# Altium schematic sheet Sheet1.SchDoc: Отладочная плата
size 209 x 297 mm; Date: 06.12.2023; ApprovedBy: Максимов; CheckedBy: Максимов; Author: Деминов; CompanyName: АГУ; DrawnBy: Деминов; Engineer: Деминов; Organization: АГУ; DocumentNumber: № 1AA; SheetTotal: 1; PageSetup: Record=PageOptions|CenterHorizontal=True|CenterVertical=True|PrintScale=0.94|XCorrection=1.00|YCorrection=1.00|PrintKind=2|BorderSize=5000000|LeftOffset=0|BottomOffset=0|Orientation=1|PaperLength=2970|PaperWidth=2100|Scale=100|PaperSource=7|PrintQuality=600|MediaType=1|DitherType=10|PaperKind=A4|PrintScaleMode=1; Title1str: на зачёт; DocumentType: Тип схемы; Format: A4; ImagePath: 1
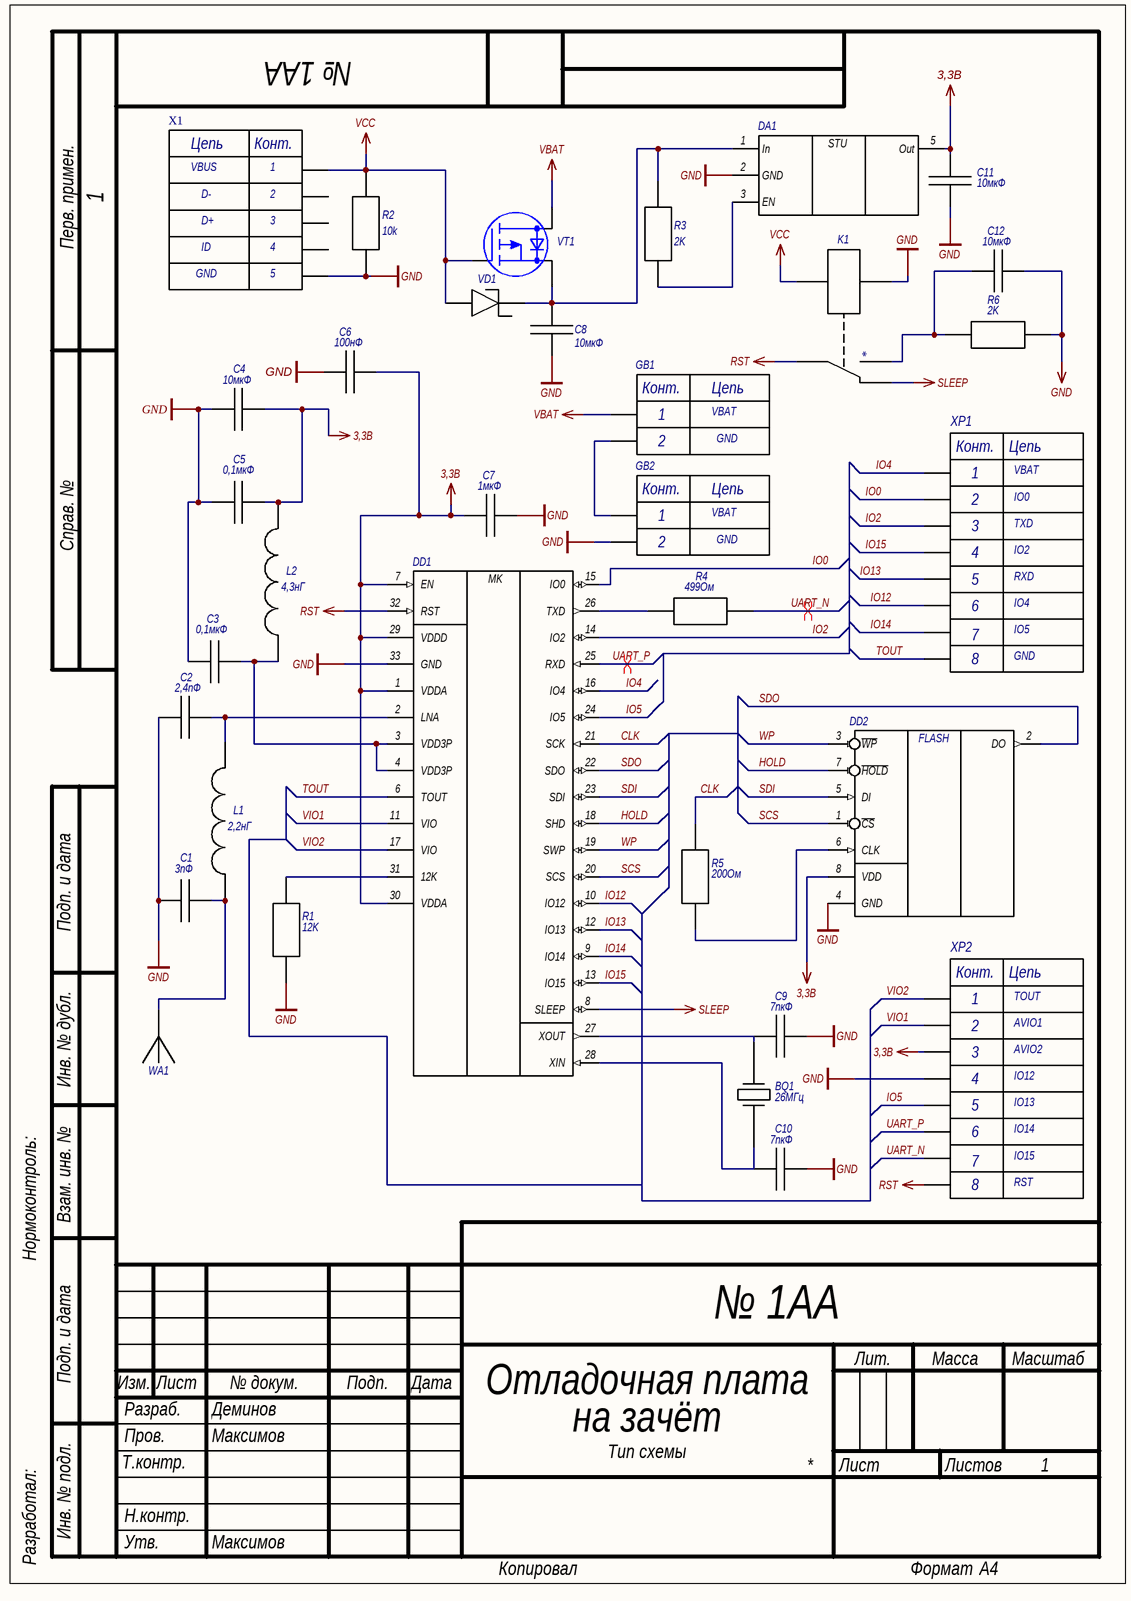
[diagram p0: Sheet1.SchDoc]

## Parts
*  WA1
BQ1  26МГц  [SMD02520C4]
C1  3пФ  [0201 C0G 7пФ 25В]
C2  2,4пФ  [0201 C0G 7пФ 25В]
C3  0,1мкФ  [RES 0402]
C4  10мкФ  [FB 0603]
C5  0,1мкФ  [RES 0402]
C6  100нФ  [RES 0402]
C7  1мкФ  [FB 0603]
C8  10мкФ  [FB 0603]
C9  7пкФ  [0201 C0G 7пФ 25В]
C10  7пкФ  [0201 C0G 7пФ 25В]
C11  10мкФ  [FB 0603]
C12  10мкФ  [FB 0603]
DA1  ap2112  [2112]  (value not drawn)
DD1  esp8266ex  [ESP8266]  (value not drawn)
DD2  M25P16-VMN6TP  [SOIC-8(3.90мм)]  (value not drawn)
GB1  battery_x2  [Battery_x2AA]  (value not drawn)
GB2  battery_x2  [Battery_x2AA]  (value not drawn)
K1  gost relay  [RELE]  (value not drawn)
L1  2,2нГ  [FB 0603]
L2  4,3нГ  [RES 0402]
R1  12K  [RES 0805]
R2  10k  [RES 0805]
R3  2K  [RES 0805]
R4  499Ом  [RES 0805]
R5  200Ом  [RES 0805]
R6  2K  [RES 0805]
VD1  (no value)  [MBR120]
VT1  (no value)  [SOT23-3]
X1  usb_micro  [USB_mini_B]  (value not drawn)
XP1  PLD-8  [PLD-8]  (value not drawn)
XP2  PLD-8  [PLD-8]  (value not drawn)

## Nets
3,3B: C4.2 C5.1 C6.1 C7.1 C11.2 DA1.5(Out) DD1.1(VDDA) DD1.7(EN) DD1.29(VDDD) DD1.30(VDDA) DD2.8(VDD) L2.2 XP2.3
GND: C1.2 C2.2 C3.2 C4.1 C5.2 C6.2 C7.2 C8.1 C9.1 C10.1 C11.1 C12.1 DA1.2(GND) DD1.33(GND) DD2.4(GND) GB2.2 K1.8 R1.2 R2.2 R6.1 X1.5 XP2.4
RST: DD1.32(RST) K1.3 XP2.8
SLEEP: DD1.8(SLEEP) K1.4
VBAT: GB1.1 VT1.2(D)
VCC: K1.1 R2.1 VD1.2 VT1.1(G) X1.1
CLK: DD1.21(SCK) R5.1
HOLD: DD1.18(SHD) DD2.7(~{HOLD})
IO0: DD1.15(IO0) XP1.2
IO2: DD1.14(IO2) XP1.3
IO4: DD1.16(IO4) XP1.1
IO5: DD1.24(IO5) XP2.5
IO12: DD1.10(IO12) XP1.6
IO13: DD1.12(IO13) XP1.5
IO14: DD1.9(IO14) XP1.7
IO15: DD1.13(IO15) XP1.4
SCS: DD1.20(SCS) DD2.1(~{CS})
SDI: DD1.23(SDI) DD2.5(DI)
SDO: DD1.22(SDO) DD2.2(DO)
TOUT: DD1.6(TOUT) XP1.8
UART_N: R4.2 XP2.7
UART_P: DD1.25(RXD) XP2.6
VIO1: DD1.11(VIO) XP2.2
VIO2: DD1.17(VIO) XP2.1
WP: DD1.19(SWP) DD2.3(~{WP})
Net*_IN: *.IN C1.1 L1.1
NetBQ1_1: BQ1.1 C10.2 DD1.28(XIN)
NetBQ1_3: BQ1.3 C9.2 DD1.27(XOUT)
NetC2_1: C2.1 DD1.2(LNA) L1.2
NetC3_1: C3.1 DD1.3(VDD3P) DD1.4(VDD3P) L2.1
NetC8_2: C8.2 DA1.1(In) R3.2 VD1.1 VT1.3(S)
NetC12_2: C12.2 K1.3 R6.2
NetDA1_3: DA1.3(EN) R3.1
NetDD1_26: DD1.26(TXD) R4.1
NetDD1_31: DD1.31(12K) R1.1
NetDD2_6: DD2.6(CLK) R5.2
NetGB1_2: GB1.2 GB2.1

Not connected (* = marked no-connect by the designer): X1 2 3 4

## Layout directives
differential pair: UART_N, UART_P

## Notes on the sheet
- Перв. примен.
- Справ. №
- VBAT
- IO0
- TXD
- IO2
- RXD
- IO4
- IO5
- GND
- Подп. и дата
- TOUT
- Инв. № дубл.
- AVIO1
- AVIO2
- IO12
- IO13
- IO14
- Нормоконтроль:
- Взам. инв. №
- IO15
- RST
- Изм.
- Лист
- № докум.
- Подп.
- Дата
- Лит.
- Масса
- Масштаб
- Т.контр.
- Пров.
- Разраб.
- Листов
- Разработал:
- Инв. № подл.
- Н.контр.
- Утв.
- Копировал
- Формат
- (in symbol ap2112) STU
- (in symbol battery_x2) Конт.; Цепь; VBAT; GND
- (in symbol esp8266ex) MK
- (in symbol M25P16-VMN6TP) FLASH
- (in symbol PLD-8) Конт.; Цепь
- (in symbol usb_micro) Цепь; Конт.; VBUS; D-; D+; ID; GND

## Library data of the parts
* = ANT GOST: Название: Chip ANTENNA 0402 BT/WLAN; Тип: Чип-антенна; Производитель: Kyocera AVX; Номер: 8000624599; Корпус: 0402; Емкость: 1001312; Документ: Нет данных о ТУ; ComponentLink1Description: Магазин; ComponentLink1URL: https://www.chipdip.ru/product/1001312
BQ1 = LBY001XRA001: Точность: 10ppm; Частота: 26MHz; Название: SMD02520C4 26МГц 7пФ 10ppm; Тип: Кварцевый резонатор; Допуск: 10 ppm; Примечание: Встроенный термистор; Номер: 8024602401; Производитель: CREC; Документ: Нет данных о ТУ; Магазин: https://www.chipdip.ru/product0/8024602401; Корпус: SMD02520C4; Емкость: 26 МГц
C1 = 0201 cap: Корпус: 0201; Напряжение: 6,3 В; Подкласс: К; Группа: 10; Тип: Конденсатор; Допуск: 10 %; Документ: Нет данных о ТУ; Производитель: Murata; Номер: GRM0335C1E3R0CD01D; Коэффициент: C0G; Емкость: 3пФ; Магазин: https://www.chipdip.ru/product/grm0335c1e7r0bd01d; Название: 0201 C0G 7пФ 25В
C2 = 0201 cap: Корпус: 0201; Напряжение: 6,3 В; Емкость: 2,4 пФ; Подкласс: К; Группа: 10; Тип: Конденсатор; Допуск: 10 %; Документ: Нет данных о ТУ; Производитель: Murata; Номер: GRM0335C1E2R4BD01D; Коэффициент: C0G; Магазин: https://www.chipdip.ru/product/grm0335c1e7r0bd01d; Название: 0201 C0G 7пФ 25В
C3 = GRM152C80G104KE19D: Емкость: 0,1 мкФ; Название: 0402 X6S 100нФ 4В; Подкласс: К; Группа: 10; Тип: Конденсатор; Корпус: 0402; Напряжение: 4 В; Допуск: 10 В; Документ: Нет данных о ТУ; Производитель: Murata; Коэффициент: C0G; ComponentLink1Description: Магазин; ComponentLink1URL: https://www.chipdip.ru/product/grm152c80g104ke19d; Номер: GRM152C80G104KE19D
C4 C11 C12 = GRM188R60G106ME47D: Напряжение: 4 В; Название: 0603 X5R 10мкФ 4В; Подкласс: К; Группа: 10; Тип: Конденсатор; Корпус: 0603; Допуск: 20%; Документ: Нет данных о ТУ; Производитель: Murata; Коэффициент: X5R; Емкость: 10 мкФ; ComponentLink1URL: https://www.chipdip.ru/product/grm188r60g106me47d; Номер: GRM188R60G106ME47D
  C4: ComponentLink1Description: New link; ComponentLink2Description: New link; ComponentLink2URL: *
  C11 C12: Номинал: 10 мкФ; ComponentLink1Description: Магазин
C5 C6 = GRM152C80G104KE19D: Название: 0402 X6S 100нФ 4В; Подкласс: К; Группа: 10; Тип: Конденсатор; Корпус: 0402; Напряжение: 4 В; Допуск: 10 %; Документ: Нет данных о ТУ; Производитель: Murata; Коэффициент: C0G; ComponentLink1Description: Магазин; ComponentLink1URL: https://www.chipdip.ru/product/grm152c80g104ke19d; Номер: GRM152C80G104KE19D
  C5: Емкость: 0,1мкФ
  C6: Емкость: 100 нФ
C7 = CC0603KRX7R5BB105 1мкФ: Напряжение: 16 В; Название: smd 0603 X7R 1мкФ 16В; Подкласс: К; Группа: 10; Тип: Конденсатор; Корпус: 0603; Допуск: 10%; Документ: Нет данных о ТУ; Производитель: Murata; Номер: GRM188R71C105KA12D; Коэффициент: X7R; ComponentLink1Description: Магазин; ComponentLink1URL: https://www.chipdip.ru/product/grm188r71c105ka12d; Емкость: 1 мкФ
C8 = GRM188R60G106ME47D: Напряжение: 6,3 В; Название: 10 мкФ X5R 20% 6.3В 0603,; Подкласс: К; Группа: 10; Тип: Конденсатор; Корпус: 0603; Допуск: 20%; Документ: Нет данных о ТУ; Производитель: Murata; Номер: GRM188R60J106ME47D; Коэффициент: X5R; Емкость: 10 мкФ; ComponentLink1Description: Магазин; ComponentLink1URL: https://www.chipdip.ru/product/grm188r60j106me47d?ysclid=lpv7x3ki7q490893642
C9 C10 = 0201 cap: Корпус: 0201; Напряжение: 6,3 В; Емкость: 7пФ; Подкласс: К; Группа: 10; Тип: Конденсатор; Допуск: 10 %; Документ: Нет данных о ТУ; Производитель: Murata; Номер: GRM0335C1E7R0BD01D; Коэффициент: C0G; Магазин: https://www.chipdip.ru/product/grm0335c1e7r0bd01d; Название: 0201 C0G 7пФ 25В
DA1 = ap2112: Название: AP2112K-3.3TRG1; Iout: 600; Vdrop: 1300mV; Тип: Микросхема; Документ: Нет данных о ТУ; Допуск: В; Производитель: DIODES INC.; Номер: 8020603787; Корпус: AP2112K-3.3TRG1
DD1 = esp8266ex: V: 3,3; Тип: Микросхема; Номер: 8001818633; Производитель: ESPRESSIF; Документ: Нет данных о ТУ; Допуск: В; ComponentLink1Description: Магазин; ComponentLink1URL: https://www.chipdip.ru/product0/8008541739; Название: ESP8266ex; Корпус: ESP8266EX
DD2 = M25P16-VMN6TP: Max freequency: 75 MHz; VCC: 2.7…3.6V; Название: M25P16-VMN6TP 16МБит SPI 75МГц; Тип: Микросхема; Производитель: Micron Technology Inc; Номер: 9000647994; Допуск: В; Документ: Нет данных о ТУ; Link: https://www.chipdip.ru/product/m25p16-vmn6tp-tr; Корпус: M25P16-VMN6TP; ComponentLink1Description: New link; ComponentLink1URL: *
GB1 GB2 = battery_x2: Название: BH2AAPC-4-12MM; Тип: Батарейный держатель; Номер: 8008602593; Документ: Нет данных о ТУ; Производитель: Нет торговой марки; ComponentLink1Description: Магазин; ComponentLink1URL: https://www.chipdip.ru/product0/8008602593; Корпус: BH2AAPC-4-12MM
K1 = gost relay: Название: HFD4/5S(R) (IM03GR); Тип: Реле; Производитель: Xiamen Hongfa Electroacoustic Co.Ltd; Документ: Нет данных о ТУ; Номер: HFD4/5SR; ComponentLink1Description: New link; ComponentLink1URL: https://www.chipdip.ru/product/hfd4-5sr-im03gr; Корпус: HFD4/5S(R) (IM03GR)
L1 = LQW18AN2N2D: Номинал: 2.2 нГн; Название: 2.2 нГн, 0603; Емкость: 2,2 нГн; Корпус: 0603; Документ: Нет данных о ТУ; Тип: Чип-индуктивность; Допуск: 5 %; Производитель: Murata; Магазин: https://www.chipdip.ru/product/lqw18an2n2d; Номер: LQW18AN2N2D
L2 = LQP15MN4N3B02D: Индуктивность: 4.3nH; Название: 4.3 нГн, 0402; Допуск: 5%; Емкость: 4,3 нГн; Корпус: 0402; Документ: Нет данных о ТУ; Тип: Чип-индуктивность; Производитель: Murata; ComponentLink1Description: Магазин; ComponentLink1URL: https://www.chipdip.ru/product/lqp15mn4n3b02d; Номер: LQP15MN4N3B02D
R1 = RES 0805: Сопротивление: 12 кОм; Мощность: 0,125 Вт; Корпус: 0805; Название: 0.125Вт 0805 2 кОм; Тип: Чип-резистор; Допуск: 1%; Группа: 2; Подкласс: Р; Документ: Нет данных о ТУ; Производитель: Murata; Номер: RC0805FR-0712KL; Напряжение: 150 В; ComponentLink1Description: Магазин; ComponentLink1URL: https://www.chipdip.ru/product/0.125w-0805-2-kom-5
R2 = RES 0805: Корпус: 0805; Сопротивление: 10к; Мощность: 0,125 Вт; Название: 0.125Вт 0805 10 кОм; Подкласс: Р; Группа: 2; Тип: Чип-резистор; Допуск: 1%; Документ: Нет данных о ТУ; Производитель: Murata; Номер: RC0805FR-0710KL; Напряжение: 150 В; ComponentLink1Description: Магазин; ComponentLink1URL: https://www.chipdip.ru/product/0.125w-0805-10-kom-1
R3 R6 = RES 0805: Сопротивление: 2 кОм; Мощность: 0,125 Вт; Корпус: 0805; Название: 0.125Вт 0805 2 кОм; Тип: Чип-резистор; Допуск: 5%; Группа: 2; Подкласс: Р; Документ: Нет данных о ТУ; Производитель: Murata; Номер: RC0805JR-072KL; Напряжение: 150 В; ComponentLink1Description: Магазин; ComponentLink1URL: https://www.chipdip.ru/product/0.125w-0805-2-kom-5
R4 = RES 0805: Мощность: 0,125 Вт; Корпус: 0805; Название: 0.125Вт 0805 2 кОм; Тип: Чип-резистор; Допуск: 1%; Группа: 2; Подкласс: Р; Документ: Нет данных о ТУ; Производитель: ROYALOHM; Номер: 0805S8F4990T5E; Напряжение: 150 В; Сопротивление: 499 Ом; ComponentLink1Description: Магазин; ComponentLink1URL: https://www.chipdip.ru/product/0.125w-0805-2-kom-5
R5 = RES 0805: Мощность: 0,125 Вт; Корпус: 0805; Название: 0.125Вт 0805 2 кОм; Тип: Чип-резистор; Допуск: 1%; Группа: 2; Подкласс: Р; Документ: Нет данных о ТУ; Производитель: Murata; Номер: RC0805FR-07200RL; Напряжение: 150 В; Сопротивление: 200 Ом; ComponentLink1Description: Магазин; ComponentLink1URL: https://www.chipdip.ru/product/0.125w-0805-2-kom-5
VD1 = MBR120: Название: MBR120VLSF; I: 1.0A; V: 20V; Тип: Диод; Номер: 8002985274; Группа: MBR120VLSFG; Производитель: ON Semiconductor; Корпус: SOD-123FL; Документ: Нет данных о ТУ; ComponentLink1Description: Магазин; ComponentLink1URL: https://www.chipdip.ru/product0/8002985274?ysclid=lptrg01onk92193897; Допуск: MBR120VLSFG
VT1 = SI2325DS-T1-GE3: N-MOSFET; Manufacturer: IXYS; id: mosfert31; Structure: p-channel; V drain-source max: 150B; Rds: 1,2Ohm; Gate-to-source voltage: (+-)20B; Continuous drain current: 530mA; Total gate charge: 7,7nC; Power dissipation: 750W; Название: SI2325DS-T1-GE3, 150V 530mA 750mW 1.2@10V,500mA 4.5V@250uA P Channel SOT23; Тип: Полевой транзистор; Производитель: Vishay; Корпус: SOT-23-3; Документ: Нет данных о ТУ; Part Number: SI2325DS-T1-GE3; ComponentLink1Description: Магазин; ComponentLink1URL: https://www.chipdip.ru/product1/8003370607?ysclid=lptrgqdijn885055873; Номер: SI2325DS-T1-GE3
X1 = usb_micro: Тип: Соединитель Розетка; Название: Usb mini; Корпус: Гнездо угловое 5pin SMD  USB-B mini; Производитель: TE Connectivity; Документ: Нет данных о ТУ; Номер: 1734035-2; ComponentLink1Description: Магазин; ComponentLink1URL: https://www.chipdip.ru/product/1734035-2-te
XP1 = PLD-8: PLD connector; Manufacturer: NONAME; Connector type: Вилка на плату; Number of contacts: 8; Тип: Соединитель Вилка; Название: Разъем штыревой 8 пинов; Производитель: Connfly electronic (Zhenqin); Номер: DS1021-1*8SF112-B; Документ: Нет данных о ТУ
XP2 = PLD-8: PLD connector; Manufacturer: NONAME; Connector type: Вилка на плату; Number of contacts: 8; Тип: Соединитель Вилка; Название: Разъем штыревой 8 пинов; Производитель: Connfly electronic (Zhenqin); Документ: Нет данных о ТУ; Номер: DS1021-1*8SF112-B